# Altium schematic sheet 0161_VCCDD2_CPU VR.SchDoc
size 848 x 558 mm
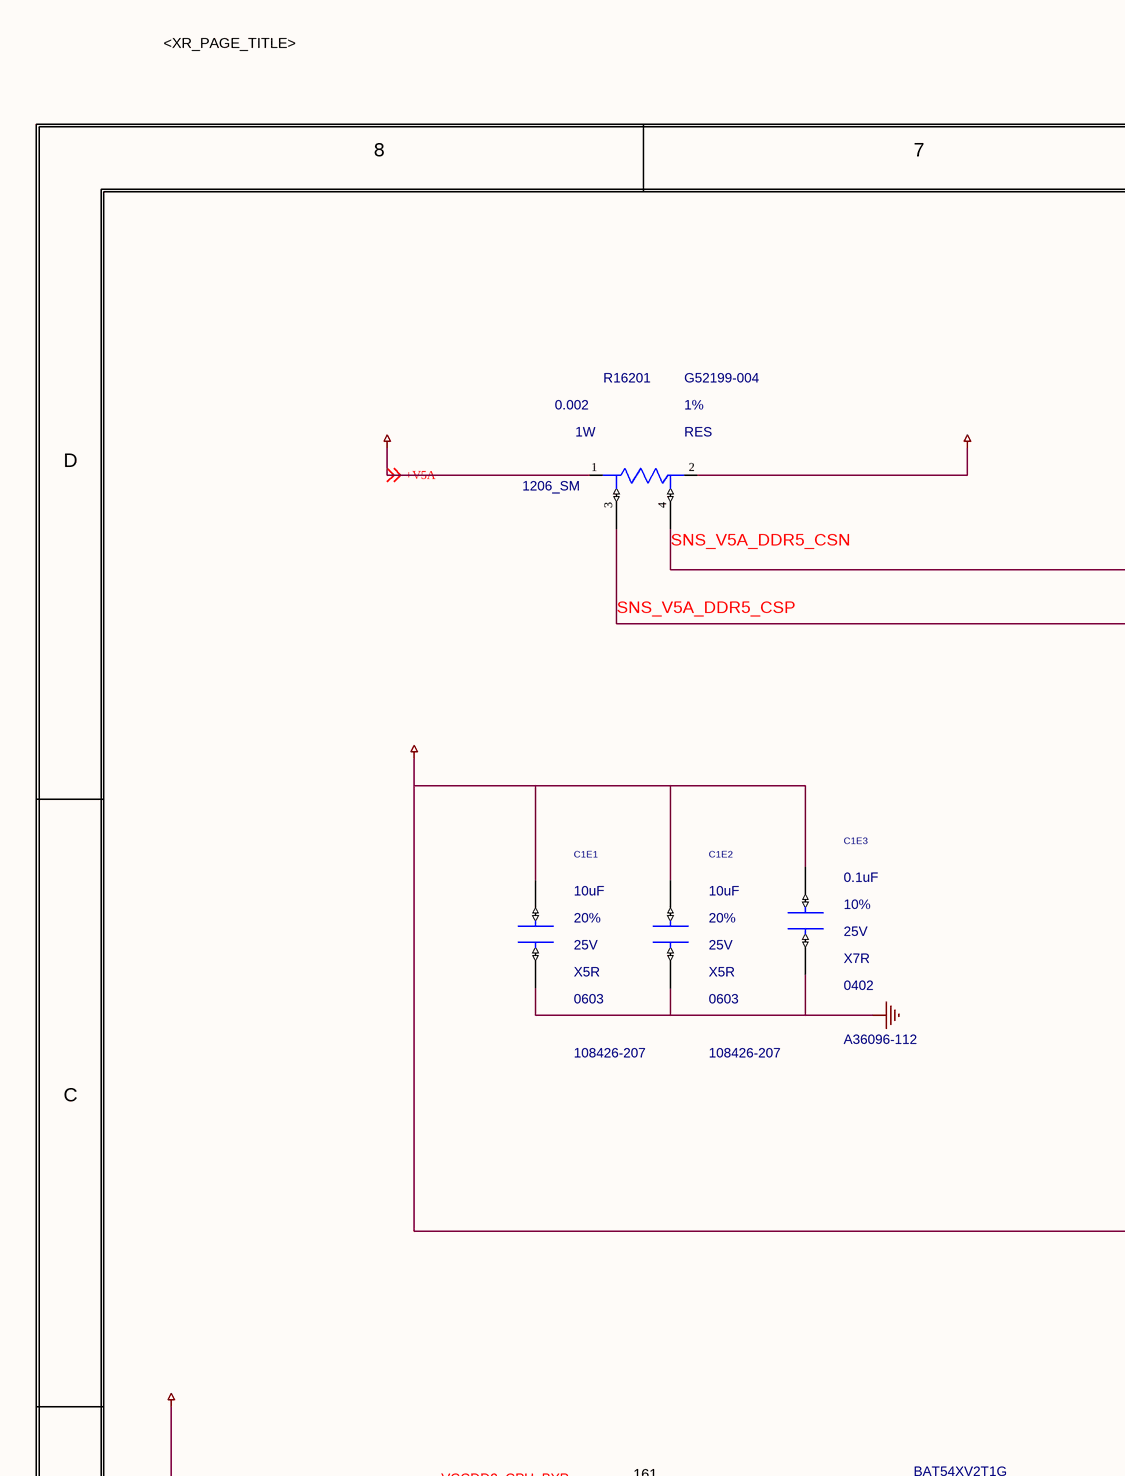
[diagram p0: 0161_VCCDD2_CPU VR.SchDoc, top left]
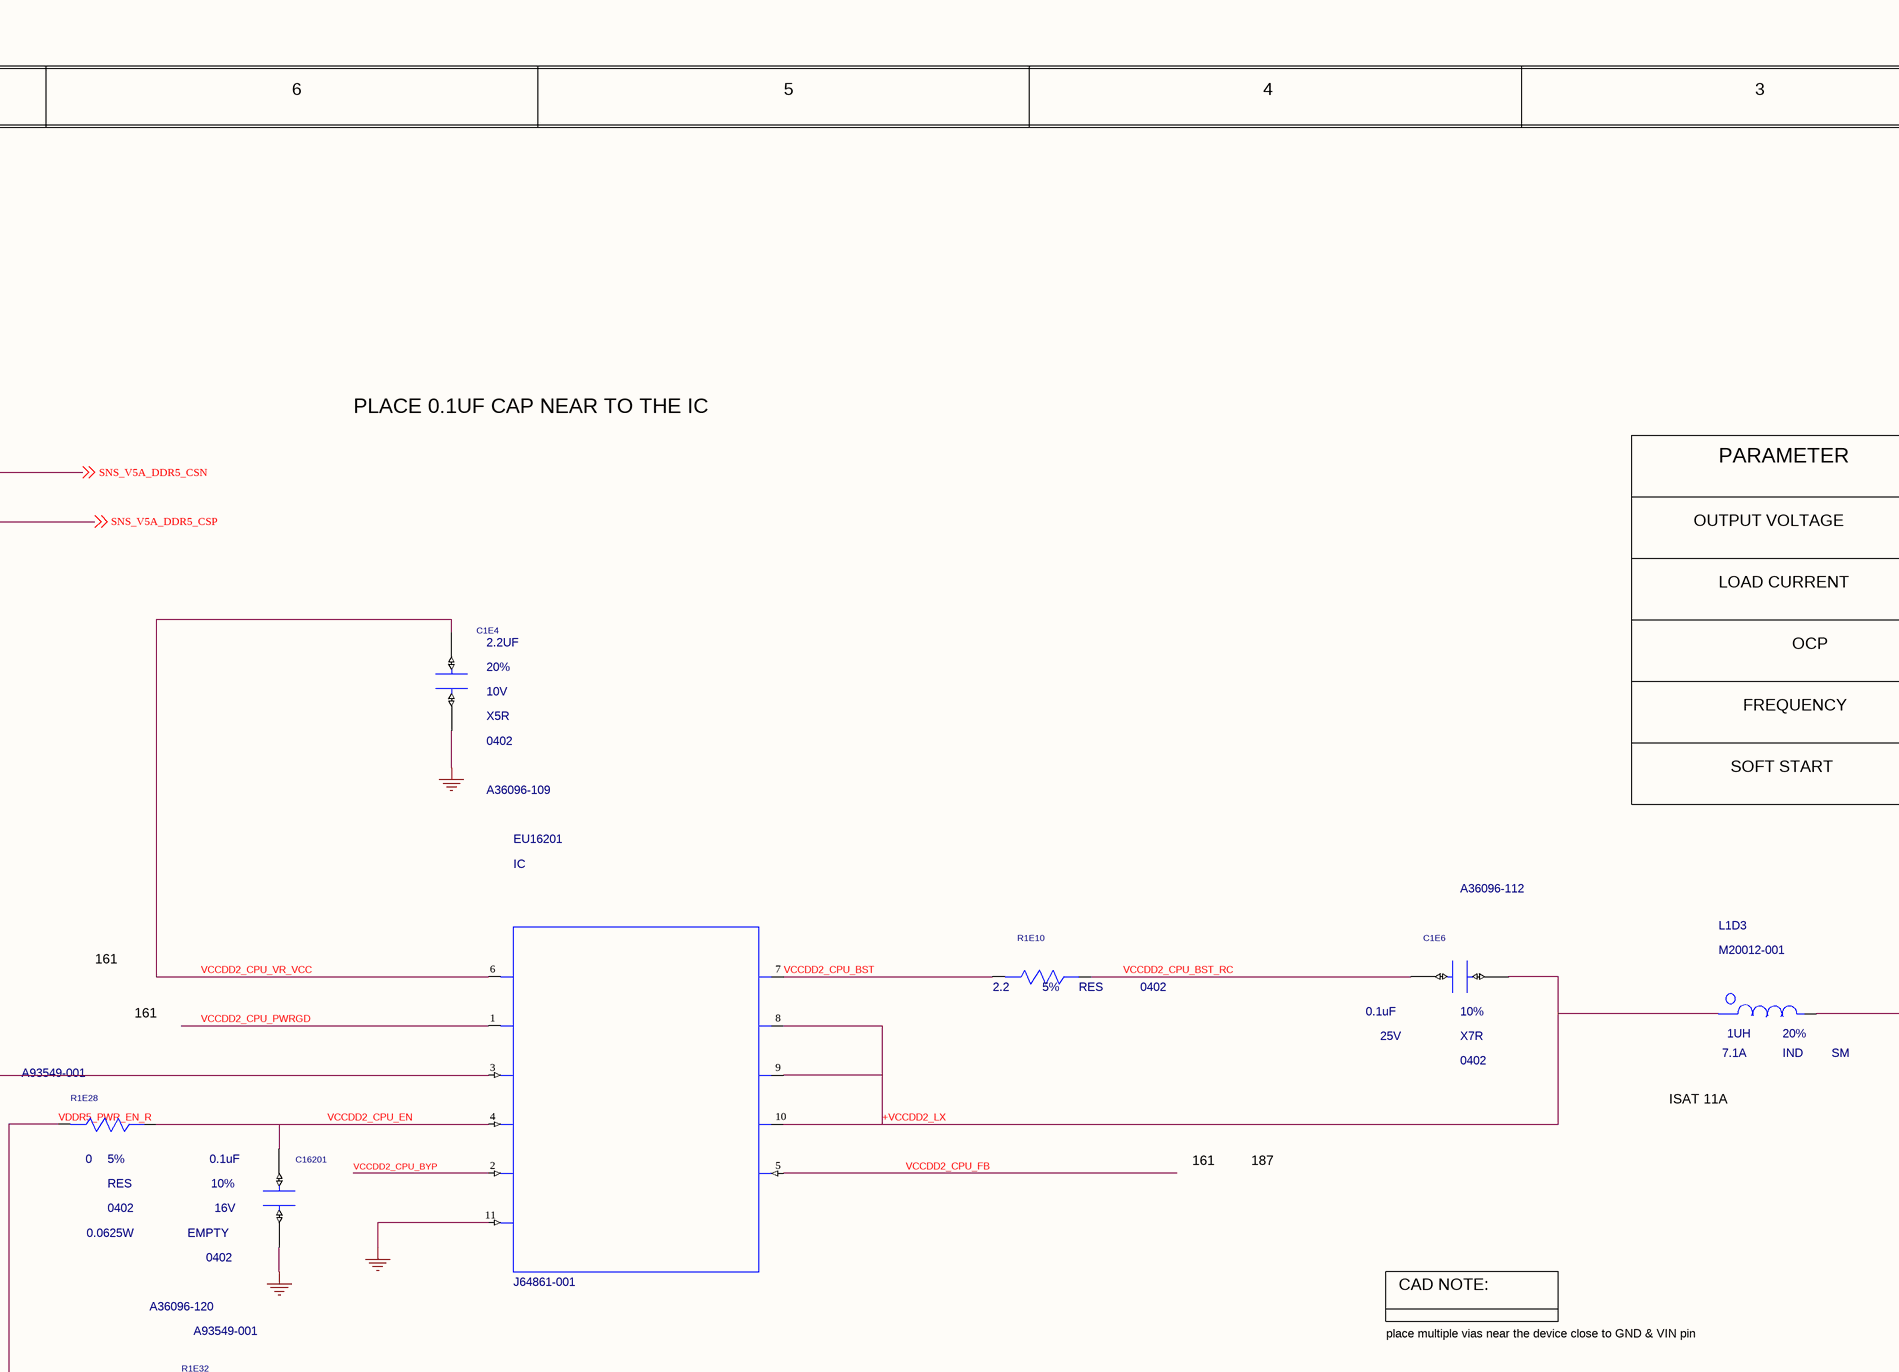
[diagram p1: 0161_VCCDD2_CPU VR.SchDoc, top middle]
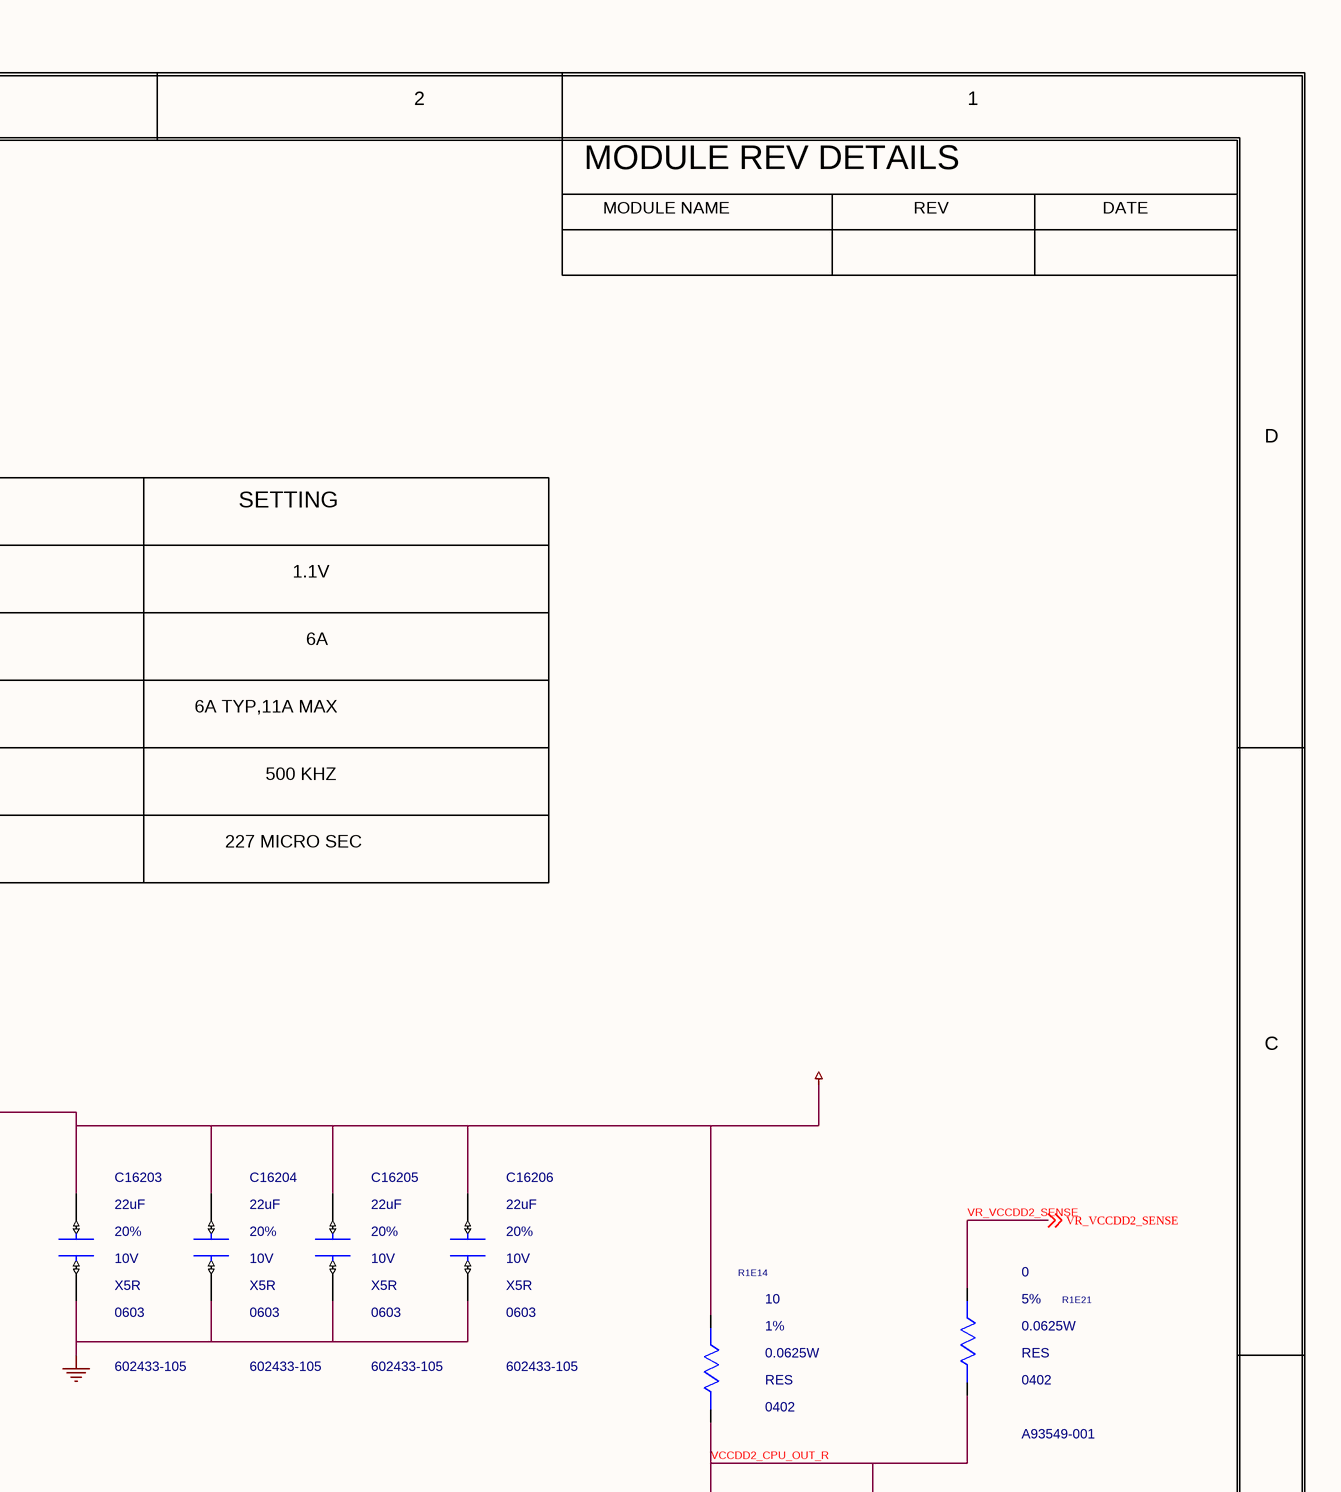
[diagram p2: 0161_VCCDD2_CPU VR.SchDoc, top right]
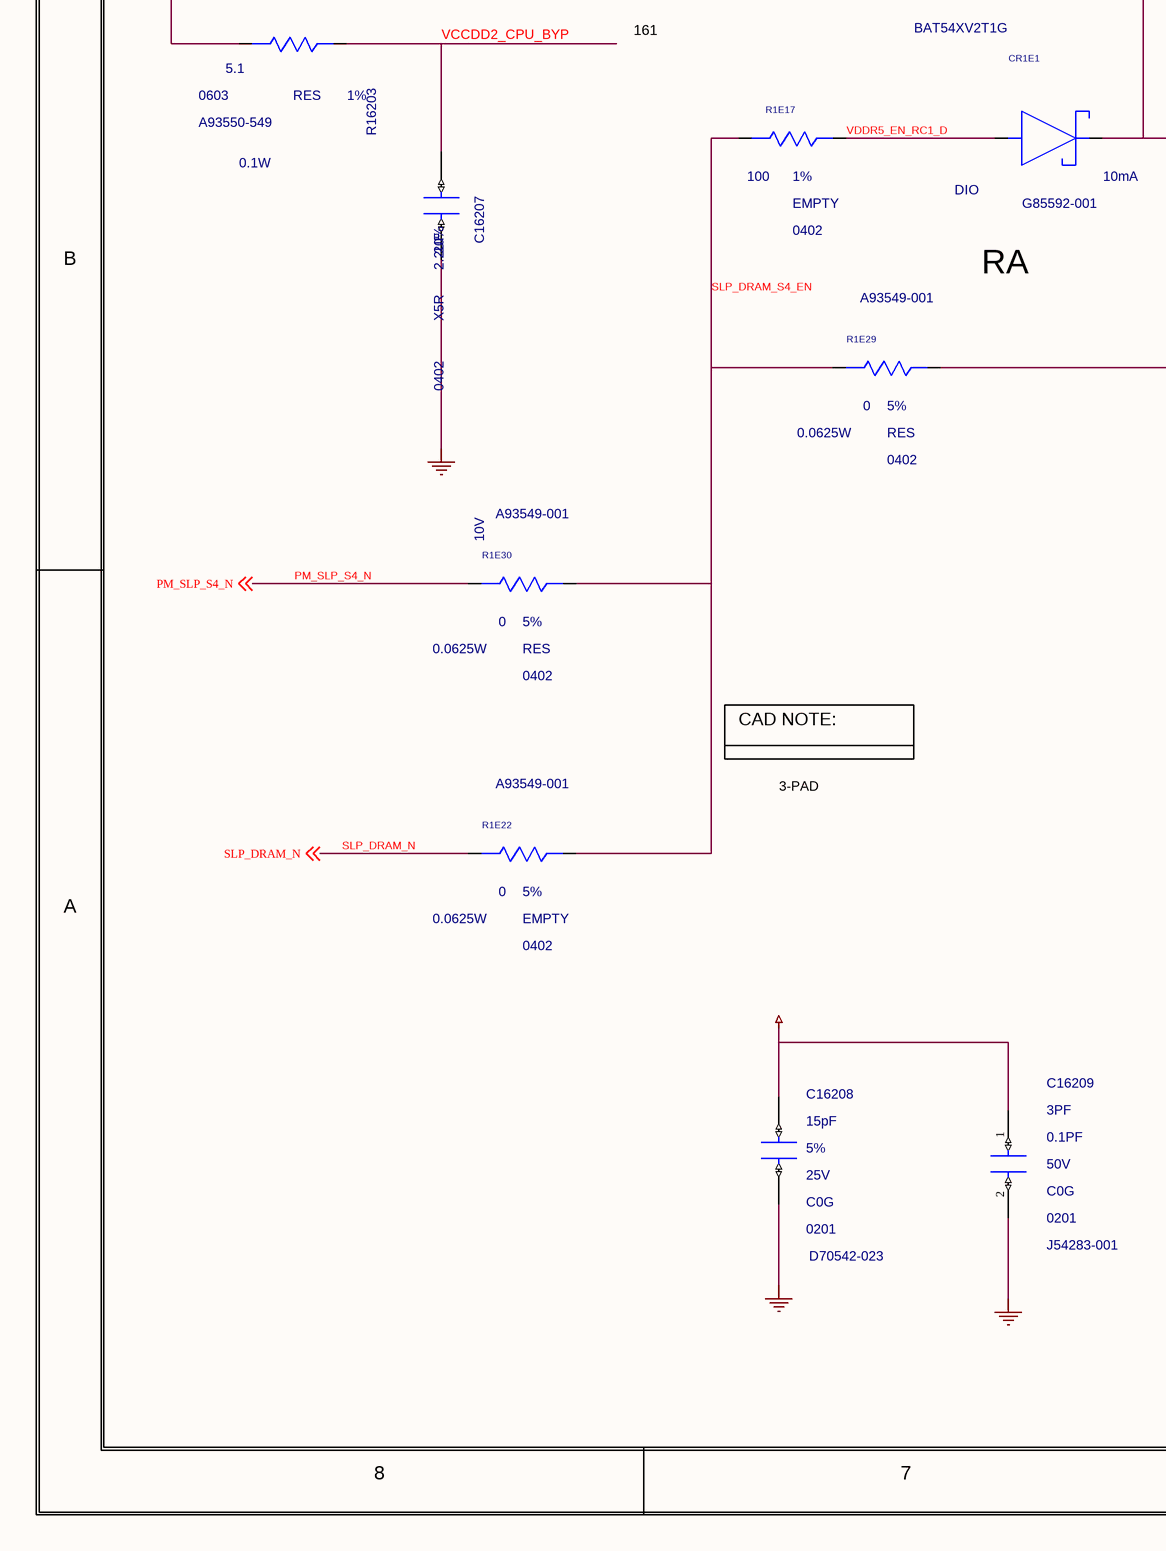
[diagram p3: 0161_VCCDD2_CPU VR.SchDoc, bottom left]
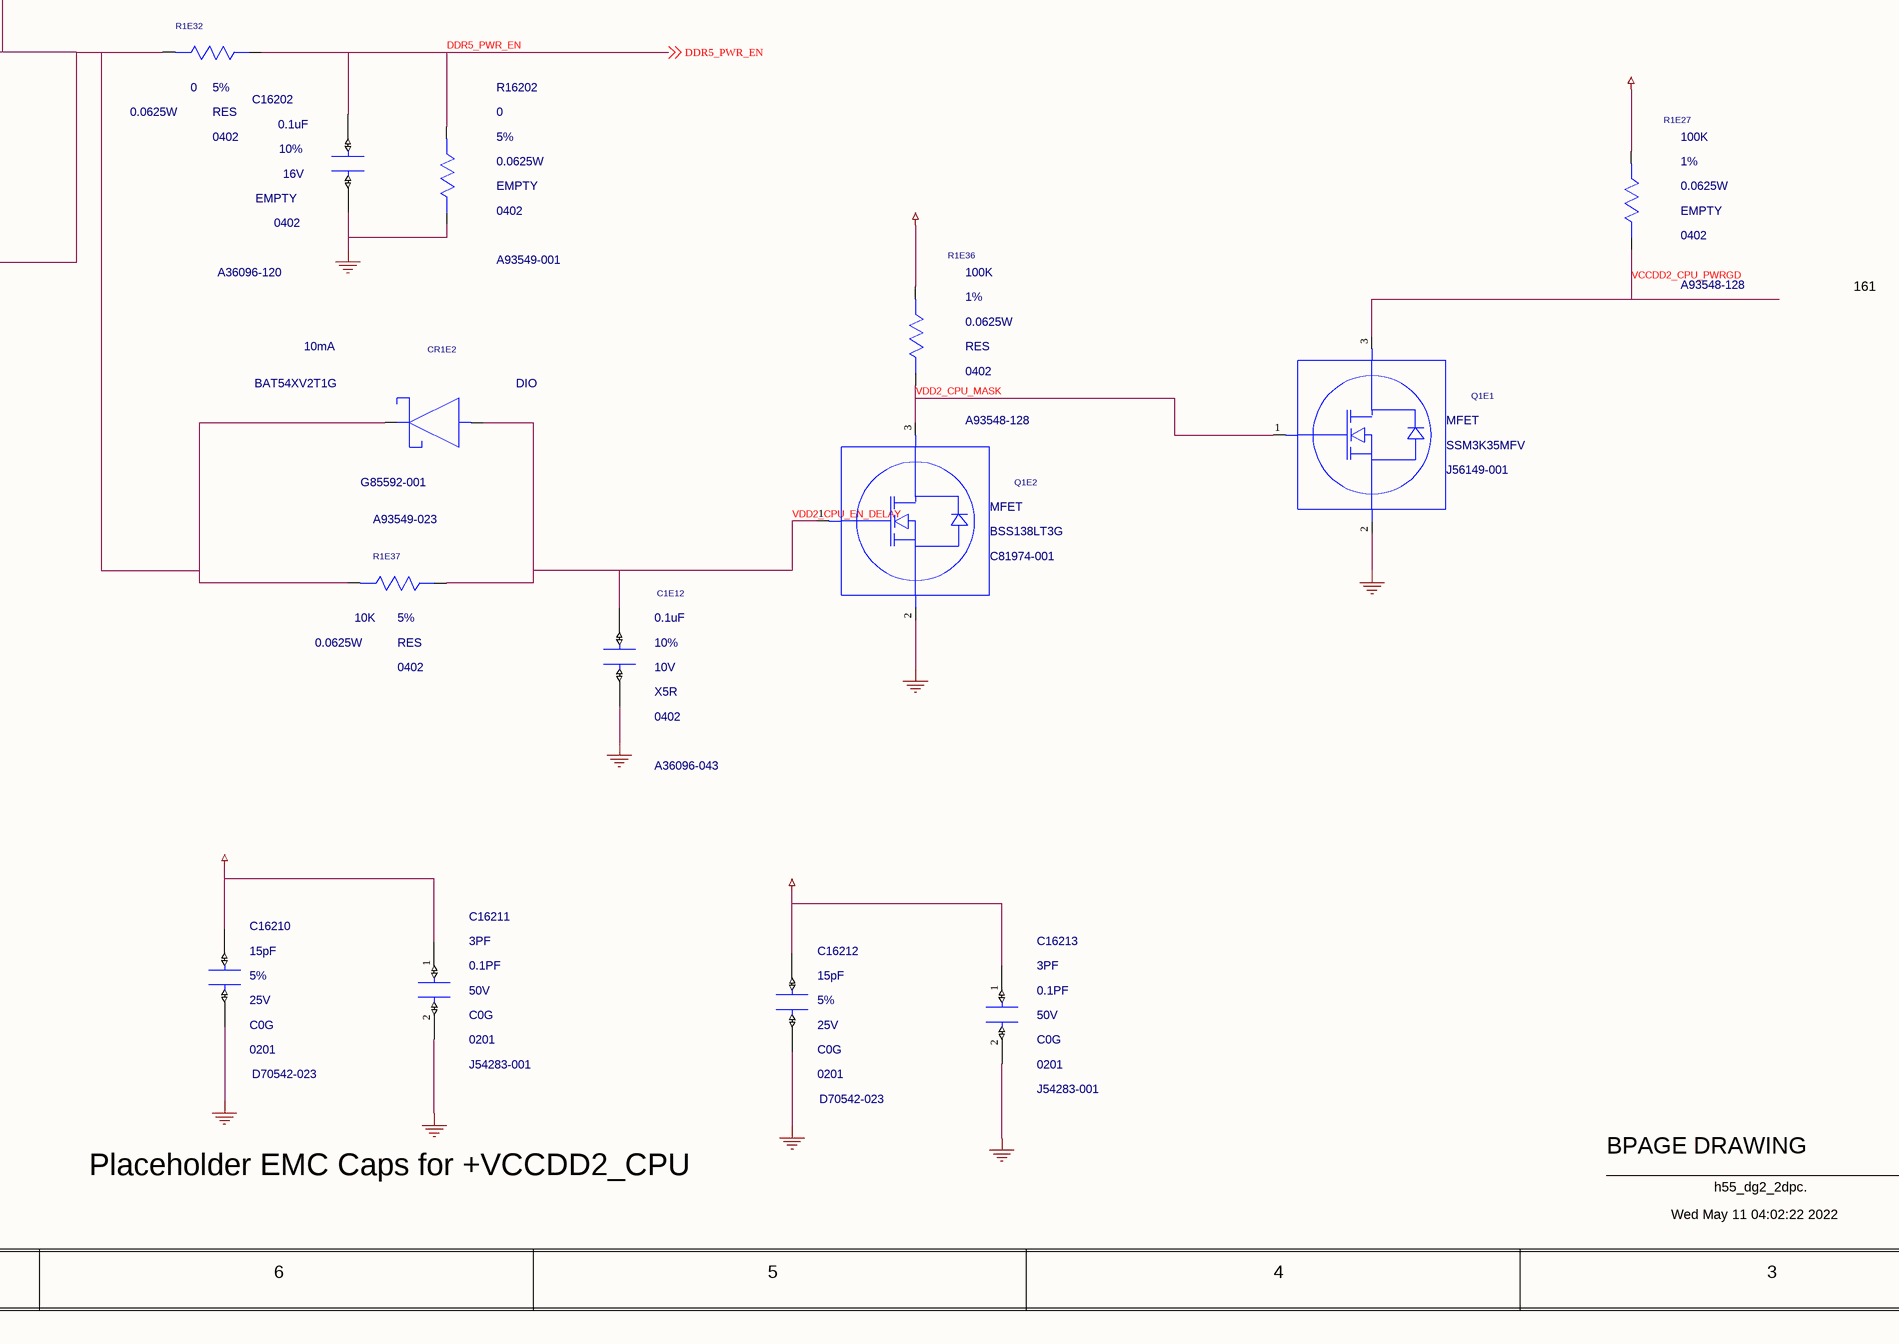
[diagram p4: 0161_VCCDD2_CPU VR.SchDoc, bottom middle]
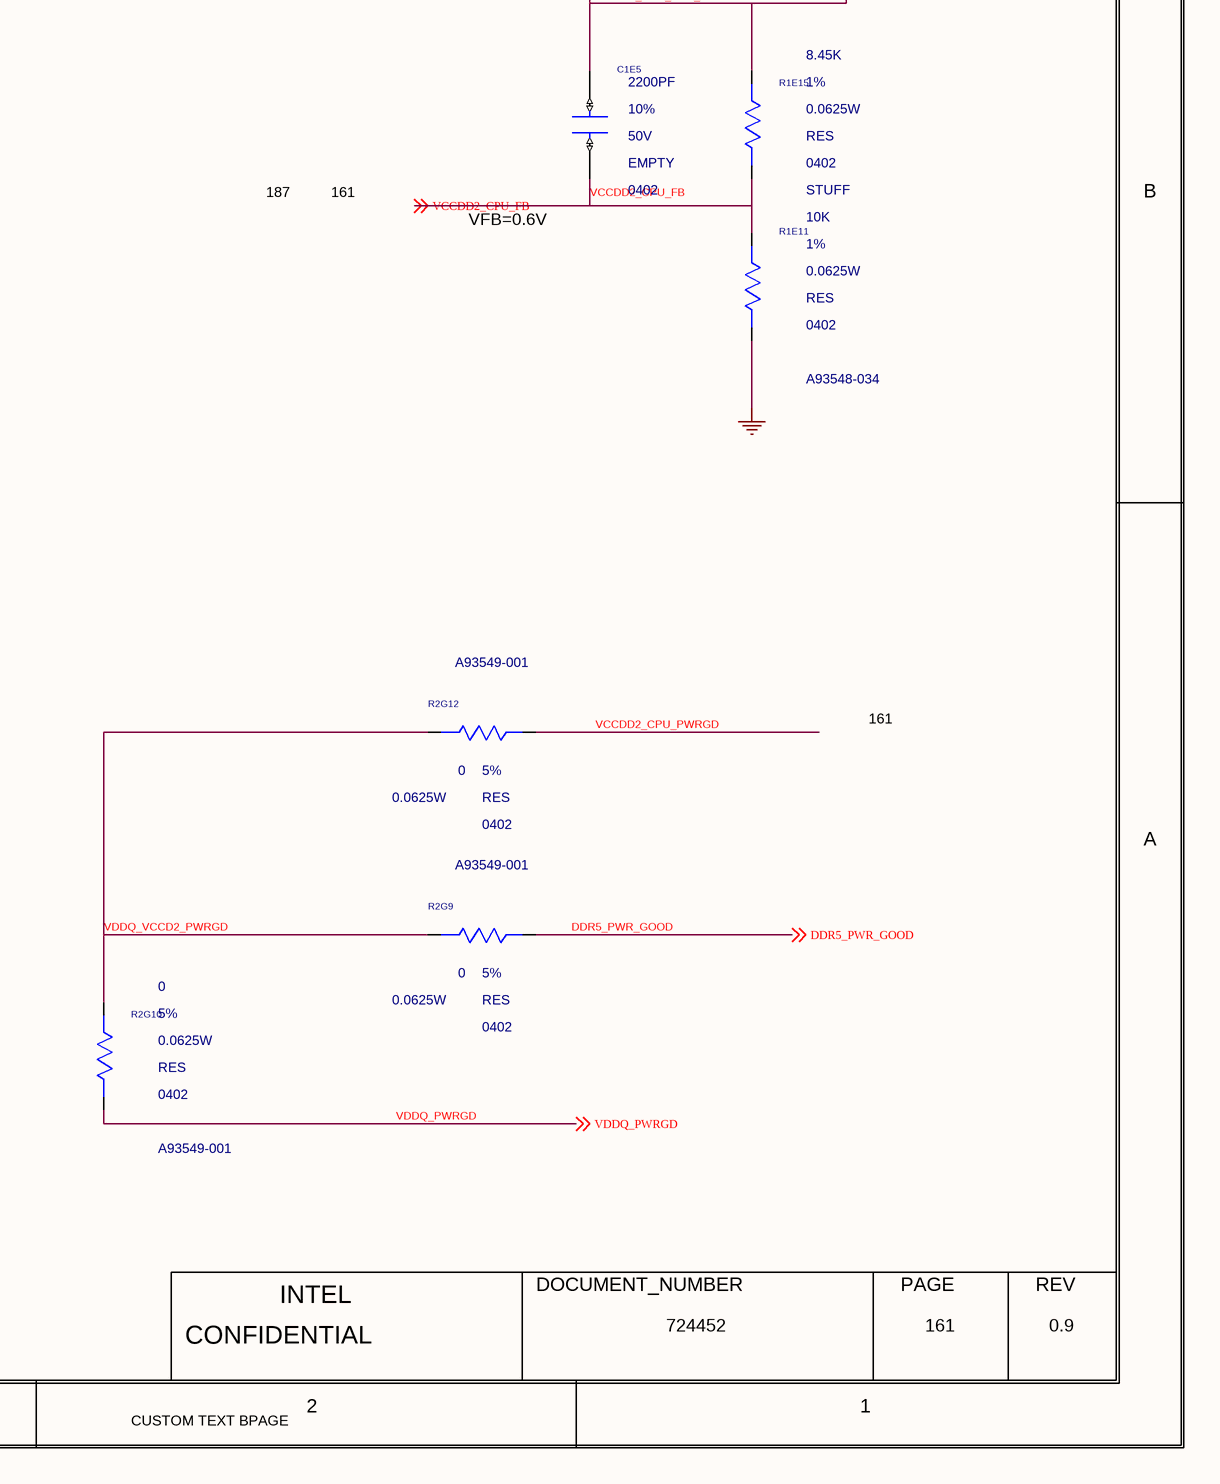
[diagram p5: 0161_VCCDD2_CPU VR.SchDoc, bottom right]

## Parts
C1E1  10uF  MATERIAL: X5R  PACK_TYPE: 0603  PART_NUMBER: 108426-207  TOLERANCE: 20%  VOLTAGE: 25V  [CTK0_SM0603_1800X1000_MA]
C1E2  10uF  MATERIAL: X5R  PACK_TYPE: 0603  PART_NUMBER: 108426-207  TOLERANCE: 20%  VOLTAGE: 25V  [CTK0_SM0603_1800X1000_MA]
C1E3  0.1uF  MATERIAL: X7R  PACK_TYPE: 0402  PART_NUMBER: A36096-112  TOLERANCE: 10%  VOLTAGE: 25V  [CTK2_SM0402_1050X550_MA]
C1E4  2.2UF  MATERIAL: X5R  PACK_TYPE: 0402  PART_NUMBER: A36096-109  TOLERANCE: 20%  VOLTAGE: 10V  [CTK0_SM0402_1070X570_MA]
C1E5  2200PF  MATERIAL: EMPTY  PACK_TYPE: 0402  TOLERANCE: 10%  VOLTAGE: 50V  [CTK0_SM0402_1100X600_MA]
C1E6  0.1uF  MATERIAL: X7R  PACK_TYPE: 0402  PART_NUMBER: A36096-112  TOLERANCE: 10%  VOLTAGE: 25V  [CTK0_SM0402_1050X550_MA]
C1E12  0.1uF  MATERIAL: X5R  PACK_TYPE: 0402  PART_NUMBER: A36096-043  TOLERANCE: 10%  VOLTAGE: 10V  [CTK0_SM0402_1050X550_MA]
C16201  0.1uF  MATERIAL: EMPTY  PACK_TYPE: 0402  PART_NUMBER: A36096-120  TOLERANCE: 10%  VOLTAGE: 16V  [CTK0_SM0402_1050X550_MA]
C16202  0.1uF  MATERIAL: EMPTY  PACK_TYPE: 0402  PART_NUMBER: A36096-120  TOLERANCE: 10%  VOLTAGE: 16V  [CTK0_SM0402_1050X550_MA]
C16203  22uF  MATERIAL: X5R  PACK_TYPE: 0603  PART_NUMBER: 602433-105  TOLERANCE: 20%  VOLTAGE: 10V  [CTK0_SM0603_1850X1050_MA]
C16204  22uF  MATERIAL: X5R  PACK_TYPE: 0603  PART_NUMBER: 602433-105  TOLERANCE: 20%  VOLTAGE: 10V  [CTK0_SM0603_1850X1050_MA]
C16205  22uF  MATERIAL: X5R  PACK_TYPE: 0603  PART_NUMBER: 602433-105  TOLERANCE: 20%  VOLTAGE: 10V  [CTK0_SM0603_1850X1050_MA]
C16206  22uF  MATERIAL: X5R  PACK_TYPE: 0603  PART_NUMBER: 602433-105  TOLERANCE: 20%  VOLTAGE: 10V  [CTK0_SM0603_1850X1050_MA]
C16207  2.2UF  MATERIAL: X5R  PACK_TYPE: 0402  TOLERANCE: 20%  VOLTAGE: 10V  [CTK2_SM0402_1070X570_MA]
C16208  15pF  MATERIAL: C0G  PACK_TYPE: 0201  PART_NUMBER: D70542-023  TOLERANCE: 5%  VOLTAGE: 25V  [CTK0_SM0201_630X330_MA]
C16209  3PF  MATERIAL: C0G  PACK_TYPE: 0201  PART_NUMBER: J54283-001  TOLERANCE: 0.1PF  VOLTAGE: 50V  [SMC0201MA]
C16210  15pF  MATERIAL: C0G  PACK_TYPE: 0201  PART_NUMBER: D70542-023  TOLERANCE: 5%  VOLTAGE: 25V  [CTK0_SM0201_630X330_MA]
C16211  3PF  MATERIAL: C0G  PACK_TYPE: 0201  PART_NUMBER: J54283-001  TOLERANCE: 0.1PF  VOLTAGE: 50V  [SMC0201MA]
C16212  15pF  MATERIAL: C0G  PACK_TYPE: 0201  PART_NUMBER: D70542-023  TOLERANCE: 5%  VOLTAGE: 25V  [CTK0_SM0201_630X330_MA]
C16213  3PF  MATERIAL: C0G  PACK_TYPE: 0201  PART_NUMBER: J54283-001  TOLERANCE: 0.1PF  VOLTAGE: 50V  [SMC0201MA]
CR1E1  BAT54XV2T1G  CURRENT: 10mA  MATERIAL: DIO  PART_NUMBER: G85592-001  [CTK2_SCR_1300X900_MA]
CR1E2  BAT54XV2T1G  CURRENT: 10mA  MATERIAL: DIO  PART_NUMBER: G85592-001  [CTK2_SCR_1300X900_MA]
EU16201  MATERIAL: IC  PART_NUMBER: J64861-001  [CTK2_LCC10_S3050_DF1625X2475_500_MA]  (hidden comment: C_RT6219)
L1D3  1UH  CURRENT: 7.1A  MATERIAL: IND  PACK_TYPE: SM  PART_NUMBER: M20012-001  TOLERANCE: 20%  [CTK0_SMI3225M_3350X2650_MA_VR]
Q1E1  SSM3K35MFV  MATERIAL: MFET  PART_NUMBER: J56149-001  [CTK2_SOT723_850X1250_400_MA]
Q1E2  BSS138LT3G  MATERIAL: MFET  PART_NUMBER: C81974-001  [CTK2_SOT23_1400X3040_950_MA]
R1E10  2.2  MATERIAL: RES  PACK_TYPE: 0402  TOLERANCE: 5%  [CTK0_SM0402_1100X550_MA]
R1E11  10K  MATERIAL: RES  PACK_TYPE: 0402  PART_NUMBER: A93548-034  TOLERANCE: 1%  WATTAGE: 0.0625W  [CTK0_SM0402_1100X550_MA]
R1E14  10  MATERIAL: RES  PACK_TYPE: 0402  TOLERANCE: 1%  WATTAGE: 0.0625W  [CTK0_SM0402_1100X550_MA]
R1E15  8.45K  BOM_USE: STUFF  MATERIAL: RES  PACK_TYPE: 0402  TOLERANCE: 1%  WATTAGE: 0.0625W  [TK0_SM0402_1100X550_MD]
R1E17  100  MATERIAL: EMPTY  PACK_TYPE: 0402  TOLERANCE: 1%  [CTK0_SM0402_1050X550_MA]
R1E21  0  MATERIAL: RES  PACK_TYPE: 0402  PART_NUMBER: A93549-001  TOLERANCE: 5%  WATTAGE: 0.0625W  [CTK0_SM0402_1100X550_MA]
R1E22  0  MATERIAL: EMPTY  PACK_TYPE: 0402  PART_NUMBER: A93549-001  TOLERANCE: 5%  WATTAGE: 0.0625W  [CTK0_SM0402_1100X550_MA]
R1E27  100K  MATERIAL: EMPTY  PACK_TYPE: 0402  PART_NUMBER: A93548-128  TOLERANCE: 1%  WATTAGE: 0.0625W  [CTK0_SM0402_1100X550_MA]
R1E28  0  MATERIAL: RES  PACK_TYPE: 0402  PART_NUMBER: A93549-001  TOLERANCE: 5%  WATTAGE: 0.0625W  [CTK0_SM0402_1100X550_MA]
R1E29  0  MATERIAL: RES  PACK_TYPE: 0402  PART_NUMBER: A93549-001  TOLERANCE: 5%  WATTAGE: 0.0625W  [CTK0_SM0402_1100X550_MA]
R1E30  0  MATERIAL: RES  PACK_TYPE: 0402  PART_NUMBER: A93549-001  TOLERANCE: 5%  WATTAGE: 0.0625W  [CTK0_SM0402_1100X550_MA]
R1E32  0  MATERIAL: RES  PACK_TYPE: 0402  PART_NUMBER: A93549-001  TOLERANCE: 5%  WATTAGE: 0.0625W  [CTK0_SM0402_1100X550_MA]
R1E36  100K  MATERIAL: RES  PACK_TYPE: 0402  PART_NUMBER: A93548-128  TOLERANCE: 1%  WATTAGE: 0.0625W  [CTK2_SM0402_1100X550_MA]
R1E37  10K  MATERIAL: RES  PACK_TYPE: 0402  PART_NUMBER: A93549-023  TOLERANCE: 5%  WATTAGE: 0.0625W  [CTK0_SM0402_1100X550_MA]
R2G9  0  MATERIAL: RES  PACK_TYPE: 0402  PART_NUMBER: A93549-001  TOLERANCE: 5%  WATTAGE: 0.0625W  [CTK0_SM0402_1100X550_MA]
R2G10  0  MATERIAL: RES  PACK_TYPE: 0402  PART_NUMBER: A93549-001  TOLERANCE: 5%  WATTAGE: 0.0625W  [CTK0_SM0402_1100X550_MA]
R2G12  0  MATERIAL: RES  PACK_TYPE: 0402  PART_NUMBER: A93549-001  TOLERANCE: 5%  WATTAGE: 0.0625W  [CTK0_SM0402_1100X550_MA]
R16201  0.002  MATERIAL: RES  PACK_TYPE: 1206_SM  PART_NUMBER: G52199-004  TOLERANCE: 1%  WATTAGE: 1W  [CTK2_SMR4_1206_3454X1854_ME]
R16202  0  MATERIAL: EMPTY  PACK_TYPE: 0402  PART_NUMBER: A93549-001  TOLERANCE: 5%  WATTAGE: 0.0625W  [CTK2_SM0402_1100X550_MA]
R16203  5.1  MATERIAL: RES  PACK_TYPE: 0603  PART_NUMBER: A93550-549  TOLERANCE: 1%  WATTAGE: 0.1W  [CTK2_SM0603_1800X900_MA]

## Nets
+V3P3S: R1E27.1(A) R1E36.1(A)
+V5A: R16201.1(PWRA) R16203.2(B) ; off-sheet +V5A
+V5A_DDR5: R16201.2(PWRB)
+VBATA: C1E1.1(A) C1E2.1(A) C1E3.1(A) EU16201.3(VIN)
+VCCDD2_PROC: C16203.1(A) C16204.1(A) C16205.1(A) C16206.1(A) C16208.1(A) C16209.1(A) C16210.1(A) C16211.1(A) C16212.1(A) C16213.1(A) L1D3.2(B) R1E14.1(A)
GND: C1E1.2(B) C1E2.2(B) C1E3.2(B) C1E4.2(B) C1E12.2(B) C16201.2(B) C16202.2(B) C16203.2(B) C16204.2(B) C16205.2(B) C16206.2(B) C16207.2(B) C16208.2(B) C16209.2(B) C16210.2(B) C16211.2(B) C16212.2(B) C16213.2(B) EU16201.11(PGND_TPD) Q1E1.2(S) Q1E2.2(S) R1E11.2(B) R16202.2(B)
+VCCDD2_LX: C1E6.2(B) EU16201.8(SW_1) EU16201.9(SW_2) EU16201.10(SW_3) L1D3.1(A)
DDR5_PWR_EN: C16202.1(A) R1E32.2(B) R16202.1(A) ; off-sheet DDR5_PWR_EN
DDR5_PWR_GOOD: R2G9.2(B) ; off-sheet DDR5_PWR_GOOD
PM_SLP_S4_N: R1E30.1(A) ; off-sheet PM_SLP_S4_N
SLP_DRAM_N: R1E22.1(A) ; off-sheet SLP_DRAM_N
SLP_DRAM_S4_EN: R1E17.1(A) R1E22.2(B) R1E29.1(A) R1E30.2(B)
SNS_V5A_DDR5_CSN: R16201.4(SENB) ; off-sheet SNS_V5A_DDR5_CSN
SNS_V5A_DDR5_CSP: R16201.3(SENA) ; off-sheet SNS_V5A_DDR5_CSP
VCCDD2_CPU_BST: EU16201.7(BOOT) R1E10.1(A)
VCCDD2_CPU_BST_RC: C1E6.1(A) R1E10.2(B)
VCCDD2_CPU_BYP: C16207.1(A) EU16201.2(VBYP) R16203.1(A)
VCCDD2_CPU_EN: C16201.1(A) EU16201.4(EN) R1E28.2(B)
VCCDD2_CPU_FB: C1E5.2(B) EU16201.5(FB) R1E11.1(A) R1E15.2(B) ; off-sheet VCCDD2_CPU_FB
VCCDD2_CPU_OUT_R: C1E5.1(A) R1E14.2(B) R1E15.1(A) R1E21.2(B)
VCCDD2_CPU_PWRGD: EU16201.1(PGOOD) Q1E1.3(D) R1E27.2(B) R2G12.2(B)
VCCDD2_CPU_VR_VCC: C1E4.1(A) EU16201.6(VCC)
VDD2_CPU_EN_DELAY: C1E12.1(A) CR1E2.A(ANODE) Q1E2.1(G) R1E37.2(B)
VDD2_CPU_MASK: Q1E1.1(G) Q1E2.3(D) R1E36.2(B)
VDDQ_PWRGD: R2G10.2(B) ; off-sheet VDDQ_PWRGD
VDDQ_VCCD2_PWRGD: R2G9.1(A) R2G10.1(A) R2G12.1(A)
VDDR5_EN_RC1_D: CR1E1.A(ANODE) R1E17.2(B)
VDDR5_PWR_EN_R: CR1E1.C(CATHODE) CR1E2.C(CATHODE) R1E28.1(A) R1E29.2(B) R1E32.1(A) R1E37.1(A)
VR_VCCDD2_SENSE: R1E21.1(A) ; off-sheet VR_VCCDD2_SENSE

## Notes on the sheet
- <XR_PAGE_TITLE>
- 8
- 7
- 6
- 5
- 4
- 3
- 2
- 1
- MODULE REV DETAILS
- MODULE NAME
- REV
- DATE
- D
- PLACE 0.1UF CAP NEAR TO THE IC
- PARAMETER
- SETTING
- OUTPUT VOLTAGE
- 1.1V
- LOAD CURRENT
- 6A
- OCP
- 6A TYP,11A MAX
- FREQUENCY
- 500 KHZ
- SOFT START
- 227 MICRO SEC
- C
- 161
- ISAT 11A
- 187
- CAD NOTE:
- place multiple vias near the device close to GND & VIN pin
- B
- RA
- VFB=0.6V
- 3-PAD
- A
- Placeholder EMC Caps for +VCCDD2_CPU
- BPAGE DRAWING
- INTEL
- DOCUMENT_NUMBER
- PAGE
- Wed May 11 04:02:22 2022
- h55_dg2_2dpc.
- CONFIDENTIAL
- 724452
- 0.9
- CUSTOM TEXT BPAGE

## Library data of the parts
C1E1 = C_CAP: CDS_PHYS_PART_NAME: C_CAP_0603-108426-207,X5R,10UF,25V,20%,TK0,GENERIC; CDS_LMAN_SYM_OUTLINE: -50,50,50,-50; FP_TECH: TK0; IP: GENERIC; ROOM: NONE; OriginalSymbolOrigin: (-50,25); XY: (2350,9475); VER: 1; ROT: 0; PHYS_PAGE: 161; LOCATION: C1E1; DRAWING: @RVP1_ADL_SB_ADP_S_DDR5_SODIMM_2DPC_LIB.H55_DG2_2DPC(SCH_1):PAGE530; CDS_LIB: c_discrete; VARIANT: ?; PCB Footprint: CTK0_SM0603_1800X1000_MA; SEC_TYPE: 0603; CHIPS_PART_NAME: C_CAP; CDS_PART_NAME: C_CAP_0603-108426-207,X5R,10UF,25V,20%,TK0,GENERIC; CDS_LOCATION: C1E1
C1E2 = C_CAP: CDS_PHYS_PART_NAME: C_CAP_0603-108426-207,X5R,10UF,25V,20%,TK0,GENERIC; CDS_LMAN_SYM_OUTLINE: -50,50,50,-50; FP_TECH: TK0; IP: GENERIC; ROOM: NONE; OriginalSymbolOrigin: (-50,25); XY: (2600,9475); VER: 1; ROT: 0; PHYS_PAGE: 161; LOCATION: C1E2; DRAWING: @RVP1_ADL_SB_ADP_S_DDR5_SODIMM_2DPC_LIB.H55_DG2_2DPC(SCH_1):PAGE530; CDS_LIB: c_discrete; VARIANT: ?; PCB Footprint: CTK0_SM0603_1800X1000_MA; SEC_TYPE: 0603; CHIPS_PART_NAME: C_CAP; CDS_PART_NAME: C_CAP_0603-108426-207,X5R,10UF,25V,20%,TK0,GENERIC; CDS_LOCATION: C1E2
C1E3 = C_CAP: CDS_PHYS_PART_NAME: C_CAP_0402-A36096-112,X7R,0.1UF,25V,10%,TK2,GENERIC; CDS_LMAN_SYM_OUTLINE: -50,50,50,-50; FP_TECH: TK2; IP: GENERIC; ROOM: NONE; OriginalSymbolOrigin: (-50,25); XY: (2850,9500); VER: 1; ROT: 0; PHYS_PAGE: 161; LOCATION: C1E3; DRAWING: @RVP1_ADL_SB_ADP_S_DDR5_SODIMM_2DPC_LIB.H55_DG2_2DPC(SCH_1):PAGE530; CDS_LIB: c_discrete; VARIANT: ?; PCB Footprint: CTK2_SM0402_1050X550_MA; SEC_TYPE: 0402; CHIPS_PART_NAME: C_CAP; CDS_PART_NAME: C_CAP_0402-A36096-112,X7R,0.1UF,25V,10%,TK2,GENERIC; CDS_LOCATION: C1E3
C1E4 = C_CAP: CDS_PHYS_PART_NAME: C_CAP_0402-A36096-109,X5R,2.2UF,10V,20%,TK0,GENERIC; CDS_LMAN_SYM_OUTLINE: -50,50,50,-50; FP_TECH: TK0; IP: GENERIC; ROOM: NONE; OriginalSymbolOrigin: (-50,25); XY: (4375,9725); VER: 1; ROT: 0; PHYS_PAGE: 161; LOCATION: C1E4; DRAWING: @RVP1_ADL_SB_ADP_S_DDR5_SODIMM_2DPC_LIB.H55_DG2_2DPC(SCH_1):PAGE530; CDS_LIB: c_discrete; VARIANT: ?; PCB Footprint: CTK0_SM0402_1070X570_MA; SEC_TYPE: 0402; CHIPS_PART_NAME: C_CAP; CDS_PART_NAME: C_CAP_0402-A36096-109,X5R,2.2UF,10V,20%,TK0,GENERIC; CDS_LOCATION: C1E4
C1E5 = C_CAP: PART_NUMBER: A36096-075; CDS_PHYS_PART_NAME: C_CAP_0402-A36096-075,EMPTY,2200PF,50V,10%,TK0,GENERIC; CDS_LMAN_SYM_OUTLINE: -50,50,50,-50; FP_TECH: TK0; IP: GENERIC; ROOM: NONE; OriginalSymbolOrigin: (-50,25); XY: (8575,8175); VER: 1; ROT: 0; PHYS_PAGE: 161; LOCATION: C1E5; DRAWING: @RVP1_ADL_SB_ADP_S_DDR5_SODIMM_2DPC_LIB.H55_DG2_2DPC(SCH_1):PAGE530; CDS_LIB: c_discrete; VARIANT: ?; PCB Footprint: CTK0_SM0402_1100X600_MA; SEC_TYPE: 0402; CHIPS_PART_NAME: C_CAP; CDS_PART_NAME: C_CAP_0402-A36096-075,EMPTY,2200PF,50V,10%,TK0,GENERIC; CDS_LOCATION: C1E5
C1E6 = C_CAP#1: CHIPS_PART_NAME: C_CAP; CDS_PHYS_PART_NAME: C_CAP_0402-A36096-112,X7R,0.1UF,25V,10%,TK0,GENERIC; CDS_LMAN_SYM_OUTLINE: -50,50,50,-50; FP_TECH: TK0; IP: GENERIC; ROOM: NONE; OriginalSymbolOrigin: (-25,50); XY: (6425,9125); VER: 2; ROT: 0; PHYS_PAGE: 161; LOCATION: C1E6; DRAWING: @RVP1_ADL_SB_ADP_S_DDR5_SODIMM_2DPC_LIB.H55_DG2_2DPC(SCH_1):PAGE530; CDS_LIB: c_discrete; VARIANT: ?; PCB Footprint: CTK0_SM0402_1050X550_MA; SEC_TYPE: 0402; CDS_PART_NAME: C_CAP_0402-A36096-112,X7R,0.1UF,25V,10%,TK0,GENERIC; CDS_LOCATION: C1E6
C1E12 = C_CAP: CDS_PHYS_PART_NAME: C_CAP_0402-A36096-043,X5R,0.1UF,10V,10%,TK0,GENERIC; CDS_LMAN_SYM_OUTLINE: -50,50,50,-50; FP_TECH: TK0; IP: GENERIC; ROOM: NONE; OriginalSymbolOrigin: (-50,25); XY: (4725,7050); VER: 1; ROT: 0; PHYS_PAGE: 161; LOCATION: C1E12; DRAWING: @RVP1_ADL_SB_ADP_S_DDR5_SODIMM_2DPC_LIB.H55_DG2_2DPC(SCH_1):PAGE530; CDS_LIB: c_discrete; VARIANT: ?; PCB Footprint: CTK0_SM0402_1050X550_MA; SEC_TYPE: 0402; CHIPS_PART_NAME: C_CAP; CDS_PART_NAME: C_CAP_0402-A36096-043,X5R,0.1UF,10V,10%,TK0,GENERIC; CDS_LOCATION: C1E12
C16201 = C_CAP: CDS_PHYS_PART_NAME: C_CAP_0402-A36096-120,EMPTY,0.1UF,16V,10%,TK0,GENERIC; CDS_LMAN_SYM_OUTLINE: -50,50,50,-50; FP_TECH: TK0; IP: GENERIC; ROOM: NONE; OriginalSymbolOrigin: (-50,25); XY: (4025,8675); VER: 1; ROT: 2; PHYS_PAGE: 161; LOCATION: C16201; DRAWING: @RVP1_ADL_SB_ADP_S_DDR5_SODIMM_2DPC_LIB.H55_DG2_2DPC(SCH_1):PAGE530; CDS_LIB: c_discrete; VARIANT: ?; PCB Footprint: CTK0_SM0402_1050X550_MA; SEC_TYPE: 0402; CHIPS_PART_NAME: C_CAP; CDS_PART_NAME: C_CAP_0402-A36096-120,EMPTY,0.1UF,16V,10%,TK0,GENERIC; CDS_LOCATION: C16201
C16202 = C_CAP: CDS_PHYS_PART_NAME: C_CAP_0402-A36096-120,EMPTY,0.1UF,16V,10%,TK0,GENERIC; CDS_LMAN_SYM_OUTLINE: -50,50,50,-50; FP_TECH: TK0; IP: GENERIC; ROOM: NONE; OriginalSymbolOrigin: (-50,25); XY: (4175,8050); VER: 1; ROT: 2; PHYS_PAGE: 161; LOCATION: C16202; DRAWING: @RVP1_ADL_SB_ADP_S_DDR5_SODIMM_2DPC_LIB.H55_DG2_2DPC(SCH_1):PAGE530; CDS_LIB: c_discrete; VARIANT: ?; PCB Footprint: CTK0_SM0402_1050X550_MA; SEC_TYPE: 0402; CHIPS_PART_NAME: C_CAP; CDS_PART_NAME: C_CAP_0402-A36096-120,EMPTY,0.1UF,16V,10%,TK0,GENERIC; CDS_LOCATION: C16202
C16203 = C_CAP: CDS_PHYS_PART_NAME: C_CAP_0603-602433-105,X5R,22UF,10V,20%,TK0,GENERIC; CDS_LMAN_SYM_OUTLINE: -50,50,50,-50; FP_TECH: TK0; IP: GENERIC; ROOM: NONE; OriginalSymbolOrigin: (-50,25); XY: (7400,8800); VER: 1; ROT: 0; PHYS_PAGE: 161; LOCATION: C16203; DRAWING: @RVP1_ADL_SB_ADP_S_DDR5_SODIMM_2DPC_LIB.H55_DG2_2DPC(SCH_1):PAGE530; CDS_LIB: c_discrete; VARIANT: ?; PCB Footprint: CTK0_SM0603_1850X1050_MA; SEC_TYPE: 0603; CHIPS_PART_NAME: C_CAP; CDS_PART_NAME: C_CAP_0603-602433-105,X5R,22UF,10V,20%,TK0,GENERIC; CDS_LOCATION: C16203
C16204 = C_CAP: CDS_PHYS_PART_NAME: C_CAP_0603-602433-105,X5R,22UF,10V,20%,TK0,GENERIC; CDS_LMAN_SYM_OUTLINE: -50,50,50,-50; FP_TECH: TK0; IP: GENERIC; ROOM: NONE; OriginalSymbolOrigin: (-50,25); XY: (7650,8800); VER: 1; ROT: 0; PHYS_PAGE: 161; LOCATION: C16204; DRAWING: @RVP1_ADL_SB_ADP_S_DDR5_SODIMM_2DPC_LIB.H55_DG2_2DPC(SCH_1):PAGE530; CDS_LIB: c_discrete; VARIANT: ?; PCB Footprint: CTK0_SM0603_1850X1050_MA; SEC_TYPE: 0603; CHIPS_PART_NAME: C_CAP; CDS_PART_NAME: C_CAP_0603-602433-105,X5R,22UF,10V,20%,TK0,GENERIC; CDS_LOCATION: C16204
C16205 = C_CAP: CDS_PHYS_PART_NAME: C_CAP_0603-602433-105,X5R,22UF,10V,20%,TK0,GENERIC; CDS_LMAN_SYM_OUTLINE: -50,50,50,-50; FP_TECH: TK0; IP: GENERIC; ROOM: NONE; OriginalSymbolOrigin: (-50,25); XY: (7875,8800); VER: 1; ROT: 0; PHYS_PAGE: 161; LOCATION: C16205; DRAWING: @RVP1_ADL_SB_ADP_S_DDR5_SODIMM_2DPC_LIB.H55_DG2_2DPC(SCH_1):PAGE530; CDS_LIB: c_discrete; VARIANT: ?; PCB Footprint: CTK0_SM0603_1850X1050_MA; SEC_TYPE: 0603; CHIPS_PART_NAME: C_CAP; CDS_PART_NAME: C_CAP_0603-602433-105,X5R,22UF,10V,20%,TK0,GENERIC; CDS_LOCATION: C16205
C16206 = C_CAP: CDS_PHYS_PART_NAME: C_CAP_0603-602433-105,X5R,22UF,10V,20%,TK0,GENERIC; CDS_LMAN_SYM_OUTLINE: -50,50,50,-50; FP_TECH: TK0; IP: GENERIC; ROOM: NONE; OriginalSymbolOrigin: (-50,25); XY: (8125,8800); VER: 1; ROT: 0; PHYS_PAGE: 161; LOCATION: C16206; DRAWING: @RVP1_ADL_SB_ADP_S_DDR5_SODIMM_2DPC_LIB.H55_DG2_2DPC(SCH_1):PAGE530; CDS_LIB: c_discrete; VARIANT: ?; PCB Footprint: CTK0_SM0603_1850X1050_MA; SEC_TYPE: 0603; CHIPS_PART_NAME: C_CAP; CDS_PART_NAME: C_CAP_0603-602433-105,X5R,22UF,10V,20%,TK0,GENERIC; CDS_LOCATION: C16206
C16207 = C_CAP#1: PART_NUMBER: A36096-109; CHIPS_PART_NAME: C_CAP; CDS_PHYS_PART_NAME: C_CAP_0402-A36096-109,X5R,2.2UF,10V,20%,TK2,GENERIC; CDS_LMAN_SYM_OUTLINE: -50,50,50,-50; FP_TECH: TK2; IP: GENERIC; ROOM: NONE; OriginalSymbolOrigin: (-25,50); XY: (2175,8150); VER: 2; ROT: 5; PHYS_PAGE: 161; LOCATION: C16207; DRAWING: @RVP1_ADL_SB_ADP_S_DDR5_SODIMM_2DPC_LIB.H55_DG2_2DPC(SCH_1):PAGE530; CDS_LIB: c_discrete; VARIANT: ?; PCB Footprint: CTK2_SM0402_1070X570_MA; CDS_PART_NAME: C_CAP_0402-A36096-109,X5R,2.2UF,10V,20%,TK2,GENERIC; CDS_LOCATION: C16207
C16208 = C_CAP: CDS_PHYS_PART_NAME: C_CAP_0201-D70542-023,C0G,15PF,25V,5%,TK0,GENERIC; CDS_LMAN_SYM_OUTLINE: -50,50,50,-50; FP_TECH: TK0; IP: GENERIC; ROOM: NONE; OriginalSymbolOrigin: (-50,25); XY: (2800,6400); VER: 1; ROT: 0; PHYS_PAGE: 161; LOCATION: C16208; DRAWING: @RVP1_ADL_SB_ADP_S_DDR5_SODIMM_2DPC_LIB.H55_DG2_2DPC(SCH_1):PAGE530; CDS_LIB: c_discrete; VARIANT: ?; PCB Footprint: CTK0_SM0201_630X330_MA; CHIPS_PART_NAME: C_CAP; CDS_PART_NAME: C_CAP_0201-D70542-023,C0G,15PF,25V,5%,TK0,GENERIC; CDS_LOCATION: C16208
C16209 = CAP: CDS_PHYS_PART_NAME: CAP_0201-J54283-001,C0G,3PF,50V,0.1PF,LPDB,GENERIC; OriginalSymbolOrigin: (-50,25); XY: (3225,6375); VER: 1; ROT: 0; PHYS_PAGE: 161; LOCATION: C16209; IP: GENERIC; FP_TECH: LPDB; DRAWING: @RVP1_ADL_SB_ADP_S_DDR5_SODIMM_2DPC_LIB.H55_DG2_2DPC(SCH_1):PAGE530; CDS_LIB: discrete; PCB Footprint: SMC0201MA; CHIPS_PART_NAME: CAP; CDS_PART_NAME: CAP_0201-J54283-001,C0G,3PF,50V,0.1PF,LPDB,GENERIC; CDS_LOCATION: C16209
C16210 = C_CAP: CDS_PHYS_PART_NAME: C_CAP_0201-D70542-023,C0G,15PF,25V,5%,TK0,GENERIC; CDS_LMAN_SYM_OUTLINE: -50,50,50,-50; FP_TECH: TK0; IP: GENERIC; ROOM: NONE; OriginalSymbolOrigin: (-50,25); XY: (3925,6400); VER: 1; ROT: 0; PHYS_PAGE: 161; LOCATION: C16210; DRAWING: @RVP1_ADL_SB_ADP_S_DDR5_SODIMM_2DPC_LIB.H55_DG2_2DPC(SCH_1):PAGE530; CDS_LIB: c_discrete; VARIANT: ?; PCB Footprint: CTK0_SM0201_630X330_MA; CHIPS_PART_NAME: C_CAP; CDS_PART_NAME: C_CAP_0201-D70542-023,C0G,15PF,25V,5%,TK0,GENERIC; CDS_LOCATION: C16210
C16211 = CAP: CDS_PHYS_PART_NAME: CAP_0201-J54283-001,C0G,3PF,50V,0.1PF,LPDB,GENERIC; OriginalSymbolOrigin: (-50,25); XY: (4350,6375); VER: 1; ROT: 0; PHYS_PAGE: 161; LOCATION: C16211; IP: GENERIC; FP_TECH: LPDB; DRAWING: @RVP1_ADL_SB_ADP_S_DDR5_SODIMM_2DPC_LIB.H55_DG2_2DPC(SCH_1):PAGE530; CDS_LIB: discrete; PCB Footprint: SMC0201MA; CHIPS_PART_NAME: CAP; CDS_PART_NAME: CAP_0201-J54283-001,C0G,3PF,50V,0.1PF,LPDB,GENERIC; CDS_LOCATION: C16211
C16212 = C_CAP: CDS_PHYS_PART_NAME: C_CAP_0201-D70542-023,C0G,15PF,25V,5%,TK0,GENERIC; CDS_LMAN_SYM_OUTLINE: -50,50,50,-50; FP_TECH: TK0; IP: GENERIC; ROOM: NONE; OriginalSymbolOrigin: (-50,25); XY: (5075,6350); VER: 1; ROT: 0; PHYS_PAGE: 161; LOCATION: C16212; DRAWING: @RVP1_ADL_SB_ADP_S_DDR5_SODIMM_2DPC_LIB.H55_DG2_2DPC(SCH_1):PAGE530; CDS_LIB: c_discrete; VARIANT: ?; PCB Footprint: CTK0_SM0201_630X330_MA; CHIPS_PART_NAME: C_CAP; CDS_PART_NAME: C_CAP_0201-D70542-023,C0G,15PF,25V,5%,TK0,GENERIC; CDS_LOCATION: C16212
C16213 = CAP: CDS_PHYS_PART_NAME: CAP_0201-J54283-001,C0G,3PF,50V,0.1PF,LPDB,GENERIC; OriginalSymbolOrigin: (-50,25); XY: (5500,6325); VER: 1; ROT: 0; PHYS_PAGE: 161; LOCATION: C16213; IP: GENERIC; FP_TECH: LPDB; DRAWING: @RVP1_ADL_SB_ADP_S_DDR5_SODIMM_2DPC_LIB.H55_DG2_2DPC(SCH_1):PAGE530; CDS_LIB: discrete; PCB Footprint: SMC0201MA; CHIPS_PART_NAME: CAP; CDS_PART_NAME: CAP_0201-J54283-001,C0G,3PF,50V,0.1PF,LPDB,GENERIC; CDS_LOCATION: C16213
CR1E1 = C_DIODE_SCHOTTKY: CDS_PHYS_PART_NAME: C_DIODE_SCHOTTKY_SM-G85592-001,DIO,BAT54XV2T1G,10MA,TK2,GENERIC; CDS_LMAN_SYM_OUTLINE: -50,100,50,-100; FP_TECH: TK2; IP: GENERIC; PACK_TYPE: SM; ROOM: NONE; OriginalSymbolOrigin: (-75,50); XY: (3300,8275); VER: 1; ROT: 0; PHYS_PAGE: 161; LOCATION: CR1E1; DRAWING: @RVP1_ADL_SB_ADP_S_DDR5_SODIMM_2DPC_LIB.H55_DG2_2DPC(SCH_1):PAGE530; CDS_LIB: local; VARIANT: ?; PCB Footprint: CTK2_SCR_1300X900_MA; SEC_TYPE: SM; CHIPS_PART_NAME: C_DIODE_SCHOTTKY; CDS_PART_NAME: C_DIODE_SCHOTTKY_SM-G85592-001,DIO,BAT54XV2T1G,10MA,TK2,GENERIC; CDS_LOCATION: CR1E1
CR1E2 = C_DIODE_SCHOTTKY: CDS_PHYS_PART_NAME: C_DIODE_SCHOTTKY_SM-G85592-001,DIO,BAT54XV2T1G,10MA,TK2,GENERIC; CDS_LMAN_SYM_OUTLINE: -50,100,50,-100; FP_TECH: TK2; IP: GENERIC; PACK_TYPE: SM; ROOM: NONE; OriginalSymbolOrigin: (-75,50); XY: (4350,7525); VER: 1; ROT: 2; PHYS_PAGE: 161; LOCATION: CR1E2; DRAWING: @RVP1_ADL_SB_ADP_S_DDR5_SODIMM_2DPC_LIB.H55_DG2_2DPC(SCH_1):PAGE530; CDS_LIB: local; VARIANT: ?; PCB Footprint: CTK2_SCR_1300X900_MA; SEC_TYPE: SM; CHIPS_PART_NAME: C_DIODE_SCHOTTKY; CDS_PART_NAME: C_DIODE_SCHOTTKY_SM-G85592-001,DIO,BAT54XV2T1G,10MA,TK2,GENERIC; CDS_LOCATION: CR1E2
EU16201 = C_RT6219: CDS_PHYS_PART_NAME: C_RT6219_LCC-J64861-001,IC,RT6219AGQW,TK2,GENERIC; CDS_LMAN_SYM_OUTLINE: -250,350,250,-350; FP_TECH: TK2; IP: GENERIC; PACK_TYPE: LCC; ROOM: NONE; OriginalSymbolOrigin: (-275,350); XY: (4750,8875); VER: 1; ROT: 0; PHYS_PAGE: 161; LOCATION: EU16201; DRAWING: @RVP1_ADL_SB_ADP_S_DDR5_SODIMM_2DPC_LIB.H55_DG2_2DPC(SCH_1):PAGE530; CDS_LIB: local; VARIANT: ?; PCB Footprint: CTK2_LCC10_S3050_DF1625X2475_500_MA; CHIPS_PART_NAME: C_RT6219; CDS_PART_NAME: C_RT6219_LCC-J64861-001,IC,RT6219AGQW,TK2,GENERIC; CDS_LOCATION: EU16201
L1D3 = C_INDUCTOR_POL: CDS_PHYS_PART_NAME: C_INDUCTOR_POL_SM-M20012-001,IND,1UH,20%,7.1A,TK0,GENERIC; CDS_LMAN_SYM_OUTLINE: -100,50,100,-50; FP_TECH: TK0; IP: GENERIC; ROOM: NONE; OriginalSymbolOrigin: (-100,50); XY: (7050,9050); VER: 1; ROT: 0; PHYS_PAGE: 161; LOCATION: L1D3; DRAWING: @RVP1_ADL_SB_ADP_S_DDR5_SODIMM_2DPC_LIB.H55_DG2_2DPC(SCH_1):PAGE530; CDS_LIB: local; VARIANT: ?; PCB Footprint: CTK0_SMI3225M_3350X2650_MA_VR; CHIPS_PART_NAME: C_INDUCTOR_POL; CDS_PART_NAME: C_INDUCTOR_POL_SM-M20012-001,IND,1UH,20%,7.1A,TK0,GENERIC; CDS_LOCATION: L1D3; ASI_MODEL: M20012-001
Q1E1 = C_MOSFET_N#1: CDS_PHYS_PART_NAME: C_MOSFET_N_SOT723-J56149-001,MFET,SSM3K35MFV,TK2,GENERIC; CDS_LMAN_SYM_OUTLINE: -150,150,150,-150; FP_TECH: TK2; IP: GENERIC; PACK_TYPE: SOT723; ROOM: NONE; OriginalSymbolOrigin: (-175,175); XY: (6250,7500); VER: 1; ROT: 0; PHYS_PAGE: 161; LOCATION: Q1E1; DRAWING: @RVP1_ADL_SB_ADP_S_DDR5_SODIMM_2DPC_LIB.H55_DG2_2DPC(SCH_1):PAGE530; CDS_LIB: local; VARIANT: ?; PCB Footprint: CTK2_SOT723_850X1250_400_MA; SEC_TYPE: SOT723; CHIPS_PART_NAME: C_MOSFET_N; CDS_PART_NAME: C_MOSFET_N_SOT723-J56149-001,MFET,SSM3K35MFV,TK2,GENERIC; CDS_LOCATION: Q1E1
Q1E2 = C_MOSFET_N#1: CDS_PHYS_PART_NAME: C_MOSFET_N_SOT23-C81974-001,MFET,BSS138LT3G,TK2,GENERIC; CDS_LMAN_SYM_OUTLINE: -150,150,150,-150; FP_TECH: TK2; IP: GENERIC; PACK_TYPE: SOT23; ROOM: NONE; OriginalSymbolOrigin: (-175,175); XY: (5325,7325); VER: 1; ROT: 0; PHYS_PAGE: 161; LOCATION: Q1E2; DRAWING: @RVP1_ADL_SB_ADP_S_DDR5_SODIMM_2DPC_LIB.H55_DG2_2DPC(SCH_1):PAGE530; CDS_LIB: local; VARIANT: ?; PCB Footprint: CTK2_SOT23_1400X3040_950_MA; SEC_TYPE: SOT23; CHIPS_PART_NAME: C_MOSFET_N; CDS_PART_NAME: C_MOSFET_N_SOT23-C81974-001,MFET,BSS138LT3G,TK2,GENERIC; CDS_LOCATION: Q1E2
R1E10 = C_RES#1: PART_NUMBER: A93549-051; CHIPS_PART_NAME: C_RES; CDS_PHYS_PART_NAME: C_RES_0402-A93549-051,RES,2.2,5%,0.0625W,TK0,GENERIC; CDS_LMAN_SYM_OUTLINE: -50,50,50,-50; FP_TECH: TK0; IP: GENERIC; ROOM: NONE; WATTAGE: 0.0625W; OriginalSymbolOrigin: (-75,25); XY: (5575,9125); VER: 1; ROT: 0; PHYS_PAGE: 161; LOCATION: R1E10; DRAWING: @RVP1_ADL_SB_ADP_S_DDR5_SODIMM_2DPC_LIB.H55_DG2_2DPC(SCH_1):PAGE530; CDS_LIB: c_discrete; VARIANT: ?; PCB Footprint: CTK0_SM0402_1100X550_MA; SEC_TYPE: 0402; CDS_PART_NAME: C_RES_0402-A93549-051,RES,2.2,5%,0.0625W,TK0,GENERIC; CDS_LOCATION: R1E10
R1E11 = C_RES: CDS_PHYS_PART_NAME: C_RES_0402-A93548-034,RES,10K,1%,0.0625W,TK0,GENERIC; CDS_LMAN_SYM_OUTLINE: -50,50,50,-50; FP_TECH: TK0; IP: GENERIC; ROOM: NONE; OriginalSymbolOrigin: (-25,75); XY: (8875,7875); VER: 2; ROT: 0; PHYS_PAGE: 161; LOCATION: R1E11; DRAWING: @RVP1_ADL_SB_ADP_S_DDR5_SODIMM_2DPC_LIB.H55_DG2_2DPC(SCH_1):PAGE530; CDS_LIB: c_discrete; VARIANT: ?; PCB Footprint: CTK0_SM0402_1100X550_MA; SEC_TYPE: 0402; CHIPS_PART_NAME: C_RES; CDS_PART_NAME: C_RES_0402-A93548-034,RES,10K,1%,0.0625W,TK0,GENERIC; CDS_LOCATION: R1E11
R1E14 = C_RES: PART_NUMBER: A93548-031; CDS_PHYS_PART_NAME: C_RES_0402-A93548-031,RES,10,1%,0.0625W,TK0,GENERIC; CDS_LMAN_SYM_OUTLINE: -50,50,50,-50; FP_TECH: TK0; IP: GENERIC; ROOM: NONE; OriginalSymbolOrigin: (-25,75); XY: (8575,8575); VER: 2; ROT: 0; PHYS_PAGE: 161; LOCATION: R1E14; DRAWING: @RVP1_ADL_SB_ADP_S_DDR5_SODIMM_2DPC_LIB.H55_DG2_2DPC(SCH_1):PAGE530; CDS_LIB: c_discrete; VARIANT: ?; PCB Footprint: CTK0_SM0402_1100X550_MA; SEC_TYPE: 0402; CHIPS_PART_NAME: C_RES; CDS_PART_NAME: C_RES_0402-A93548-031,RES,10,1%,0.0625W,TK0,GENERIC; CDS_LOCATION: R1E14
R1E15 = RES_2: PART_NUMBER: A93548-275; CDS_PHYS_PART_NAME: RES_2_0402-A93548-275,RES,8.45K,1%,0.0625W,TK0,GENERIC; CDS_LMAN_SYM_OUTLINE: -50,50,50,-50; FP_TECH: TK0; IP: GENERIC; ROOM: NONE; OriginalSymbolOrigin: (-25,75); XY: (8875,8175); VER: 2; ROT: 0; PHYS_PAGE: 161; LOCATION: R1E15; DRAWING: @RVP1_ADL_SB_ADP_S_DDR5_SODIMM_2DPC_LIB.H55_DG2_2DPC(SCH_1):PAGE530; CDS_LIB: discrete_2; VARIANT: ?; PCB Footprint: TK0_SM0402_1100X550_MD; SEC_TYPE: 0402; CHIPS_PART_NAME: RES_2; CDS_PART_NAME: RES_2_0402-A93548-275,RES,8.45K,1%,0.0625W,TK0,GENERIC; CDS_LOCATION: R1E15
R1E17 = C_RES#1: PART_NUMBER: A36092-043; CHIPS_PART_NAME: C_RES; CDS_PHYS_PART_NAME: C_RES_0402-A36092-043,EMPTY,100,1%,0.0625W,TK0,GENERIC; CDS_LMAN_SYM_OUTLINE: -50,50,50,-50; FP_TECH: TK0; IP: GENERIC; ROOM: NONE; WATTAGE: 0.0625W; OriginalSymbolOrigin: (-75,25); XY: (2825,8275); VER: 1; ROT: 0; PHYS_PAGE: 161; LOCATION: R1E17; DRAWING: @RVP1_ADL_SB_ADP_S_DDR5_SODIMM_2DPC_LIB.H55_DG2_2DPC(SCH_1):PAGE530; CDS_LIB: c_discrete; VARIANT: ?; PCB Footprint: CTK0_SM0402_1050X550_MA; SEC_TYPE: 0402; CDS_PART_NAME: C_RES_0402-A36092-043,EMPTY,100,1%,0.0625W,TK0,GENERIC; CDS_LOCATION: R1E17
R1E21 = C_RES: CDS_PHYS_PART_NAME: C_RES_0402-A93549-001,RES,0,5%,0.0625W,TK0,GENERIC; CDS_LMAN_SYM_OUTLINE: -50,50,50,-50; FP_TECH: TK0; IP: GENERIC; ROOM: NONE; OriginalSymbolOrigin: (-25,75); XY: (9050,8625); VER: 2; PHYS_PAGE: 161; LOCATION: R1E21; DRAWING: @RVP1_ADL_SB_ADP_S_DDR5_SODIMM_2DPC_LIB.H55_DG2_2DPC(SCH_1):PAGE530; CDS_LIB: c_discrete; VARIANT: ?; PCB Footprint: CTK0_SM0402_1100X550_MA; SEC_TYPE: 0402; ROT: 0; CHIPS_PART_NAME: C_RES; CDS_PART_NAME: C_RES_0402-A93549-001,RES,0,5%,0.0625W,TK0,GENERIC; CDS_LOCATION: R1E21
R1E22 = C_RES#1: CHIPS_PART_NAME: C_RES; CDS_PHYS_PART_NAME: C_RES_0402-A93549-001,EMPTY,0,5%,0.0625W,TK0,GENERIC; CDS_LMAN_SYM_OUTLINE: -50,50,50,-50; FP_TECH: TK0; IP: GENERIC; ROOM: NONE; OriginalSymbolOrigin: (-75,25); XY: (2325,6950); VER: 1; PHYS_PAGE: 161; LOCATION: R1E22; DRAWING: @RVP1_ADL_SB_ADP_S_DDR5_SODIMM_2DPC_LIB.H55_DG2_2DPC(SCH_1):PAGE530; CDS_LIB: c_discrete; VARIANT: ?; PCB Footprint: CTK0_SM0402_1100X550_MA; SEC_TYPE: 0402; ROT: 0; CDS_PART_NAME: C_RES_0402-A93549-001,EMPTY,0,5%,0.0625W,TK0,GENERIC; CDS_LOCATION: R1E22
R1E27 = C_RES: CDS_PHYS_PART_NAME: C_RES_0402-A93548-128,EMPTY,100K,1%,0.0625W,TK0,GENERIC; CDS_LMAN_SYM_OUTLINE: -50,50,50,-50; FP_TECH: TK0; IP: GENERIC; ROOM: NONE; OriginalSymbolOrigin: (-25,75); XY: (6775,7975); VER: 2; ROT: 0; PHYS_PAGE: 161; LOCATION: R1E27; DRAWING: @RVP1_ADL_SB_ADP_S_DDR5_SODIMM_2DPC_LIB.H55_DG2_2DPC(SCH_1):PAGE530; CDS_LIB: c_discrete; VARIANT: ?; PCB Footprint: CTK0_SM0402_1100X550_MA; SEC_TYPE: 0402; CHIPS_PART_NAME: C_RES; CDS_PART_NAME: C_RES_0402-A93548-128,EMPTY,100K,1%,0.0625W,TK0,GENERIC; CDS_LOCATION: R1E27
R1E28 = C_RES#1: CHIPS_PART_NAME: C_RES; CDS_PHYS_PART_NAME: C_RES_0402-A93549-001,RES,0,5%,0.0625W,TK0,GENERIC; CDS_LMAN_SYM_OUTLINE: -50,50,50,-50; FP_TECH: TK0; IP: GENERIC; ROOM: NONE; OriginalSymbolOrigin: (-75,25); XY: (3675,8825); VER: 1; PHYS_PAGE: 161; LOCATION: R1E28; DRAWING: @RVP1_ADL_SB_ADP_S_DDR5_SODIMM_2DPC_LIB.H55_DG2_2DPC(SCH_1):PAGE530; CDS_LIB: c_discrete; VARIANT: ?; PCB Footprint: CTK0_SM0402_1100X550_MA; SEC_TYPE: 0402; ROT: 0; CDS_PART_NAME: C_RES_0402-A93549-001,RES,0,5%,0.0625W,TK0,GENERIC; CDS_LOCATION: R1E28
R1E29 = C_RES#1: CHIPS_PART_NAME: C_RES; CDS_PHYS_PART_NAME: C_RES_0402-A93549-001,RES,0,5%,0.0625W,TK0,GENERIC; CDS_LMAN_SYM_OUTLINE: -50,50,50,-50; FP_TECH: TK0; IP: GENERIC; ROOM: NONE; OriginalSymbolOrigin: (-75,25); XY: (3000,7850); VER: 1; PHYS_PAGE: 161; LOCATION: R1E29; DRAWING: @RVP1_ADL_SB_ADP_S_DDR5_SODIMM_2DPC_LIB.H55_DG2_2DPC(SCH_1):PAGE530; CDS_LIB: c_discrete; VARIANT: ?; PCB Footprint: CTK0_SM0402_1100X550_MA; SEC_TYPE: 0402; ROT: 0; CDS_PART_NAME: C_RES_0402-A93549-001,RES,0,5%,0.0625W,TK0,GENERIC; CDS_LOCATION: R1E29
R1E30 = C_RES#1: CHIPS_PART_NAME: C_RES; CDS_PHYS_PART_NAME: C_RES_0402-A93549-001,RES,0,5%,0.0625W,TK0,GENERIC; CDS_LMAN_SYM_OUTLINE: -50,50,50,-50; FP_TECH: TK0; IP: GENERIC; ROOM: NONE; OriginalSymbolOrigin: (-75,25); XY: (2325,7450); VER: 1; PHYS_PAGE: 161; LOCATION: R1E30; DRAWING: @RVP1_ADL_SB_ADP_S_DDR5_SODIMM_2DPC_LIB.H55_DG2_2DPC(SCH_1):PAGE530; CDS_LIB: c_discrete; VARIANT: ?; PCB Footprint: CTK0_SM0402_1100X550_MA; SEC_TYPE: 0402; ROT: 0; CDS_PART_NAME: C_RES_0402-A93549-001,RES,0,5%,0.0625W,TK0,GENERIC; CDS_LOCATION: R1E30
R1E32 = C_RES#1: CHIPS_PART_NAME: C_RES; CDS_PHYS_PART_NAME: C_RES_0402-A93549-001,RES,0,5%,0.0625W,TK0,GENERIC; CDS_LMAN_SYM_OUTLINE: -50,50,50,-50; FP_TECH: TK0; IP: GENERIC; ROOM: NONE; OriginalSymbolOrigin: (-75,25); XY: (3900,8275); VER: 1; PHYS_PAGE: 161; LOCATION: R1E32; DRAWING: @RVP1_ADL_SB_ADP_S_DDR5_SODIMM_2DPC_LIB.H55_DG2_2DPC(SCH_1):PAGE530; CDS_LIB: c_discrete; VARIANT: ?; PCB Footprint: CTK0_SM0402_1100X550_MA; SEC_TYPE: 0402; ROT: 0; CDS_PART_NAME: C_RES_0402-A93549-001,RES,0,5%,0.0625W,TK0,GENERIC; CDS_LOCATION: R1E32
R1E36 = C_RES: CDS_PHYS_PART_NAME: C_RES_0402-A93548-128,RES,100K,1%,0.0625W,TK2,GENERIC; CDS_LMAN_SYM_OUTLINE: -50,50,50,-50; FP_TECH: TK2; IP: GENERIC; ROOM: NONE; OriginalSymbolOrigin: (-25,75); XY: (5325,7700); VER: 2; ROT: 0; PHYS_PAGE: 161; LOCATION: R1E36; DRAWING: @RVP1_ADL_SB_ADP_S_DDR5_SODIMM_2DPC_LIB.H55_DG2_2DPC(SCH_1):PAGE530; CDS_LIB: c_discrete; VARIANT: ?; PCB Footprint: CTK2_SM0402_1100X550_MA; SEC_TYPE: 0402; CHIPS_PART_NAME: C_RES; CDS_PART_NAME: C_RES_0402-A93548-128,RES,100K,1%,0.0625W,TK2,GENERIC; CDS_LOCATION: R1E36
R1E37 = C_RES#1: CHIPS_PART_NAME: C_RES; CDS_PHYS_PART_NAME: C_RES_0402-A93549-023,RES,10K,5%,0.0625W,TK0,GENERIC; CDS_LMAN_SYM_OUTLINE: -50,50,50,-50; FP_TECH: TK0; IP: GENERIC; ROOM: NONE; OriginalSymbolOrigin: (-75,25); XY: (4275,7200); VER: 1; ROT: 0; PHYS_PAGE: 161; LOCATION: R1E37; DRAWING: @RVP1_ADL_SB_ADP_S_DDR5_SODIMM_2DPC_LIB.H55_DG2_2DPC(SCH_1):PAGE530; CDS_LIB: c_discrete; VARIANT: ?; PCB Footprint: CTK0_SM0402_1100X550_MA; SEC_TYPE: 0402; CDS_PART_NAME: C_RES_0402-A93549-023,RES,10K,5%,0.0625W,TK0,GENERIC; CDS_LOCATION: R1E37
R2G9 = C_RES#1: CHIPS_PART_NAME: C_RES; CDS_PHYS_PART_NAME: C_RES_0402-A93549-001,RES,0,5%,0.0625W,TK0,GENERIC; CDS_LMAN_SYM_OUTLINE: -50,50,50,-50; FP_TECH: TK0; IP: GENERIC; ROOM: NONE; OriginalSymbolOrigin: (-75,25); XY: (8375,6675); VER: 1; PHYS_PAGE: 161; LOCATION: R2G9; DRAWING: @RVP1_ADL_SB_ADP_S_DDR5_SODIMM_2DPC_LIB.H55_DG2_2DPC(SCH_1):PAGE530; CDS_LIB: c_discrete; VARIANT: ?; PCB Footprint: CTK0_SM0402_1100X550_MA; SEC_TYPE: 0402; ROT: 0; CDS_PART_NAME: C_RES_0402-A93549-001,RES,0,5%,0.0625W,TK0,GENERIC; CDS_LOCATION: R2G9
R2G10 = C_RES: CDS_PHYS_PART_NAME: C_RES_0402-A93549-001,RES,0,5%,0.0625W,TK0,GENERIC; CDS_LMAN_SYM_OUTLINE: -50,50,50,-50; FP_TECH: TK0; IP: GENERIC; ROOM: NONE; OriginalSymbolOrigin: (-25,75); XY: (7675,6450); VER: 2; PHYS_PAGE: 161; LOCATION: R2G10; DRAWING: @RVP1_ADL_SB_ADP_S_DDR5_SODIMM_2DPC_LIB.H55_DG2_2DPC(SCH_1):PAGE530; CDS_LIB: c_discrete; VARIANT: ?; PCB Footprint: CTK0_SM0402_1100X550_MA; SEC_TYPE: 0402; ROT: 0; CHIPS_PART_NAME: C_RES; CDS_PART_NAME: C_RES_0402-A93549-001,RES,0,5%,0.0625W,TK0,GENERIC; CDS_LOCATION: R2G10
R2G12 = C_RES#1: CHIPS_PART_NAME: C_RES; CDS_PHYS_PART_NAME: C_RES_0402-A93549-001,RES,0,5%,0.0625W,TK0,GENERIC; CDS_LMAN_SYM_OUTLINE: -50,50,50,-50; FP_TECH: TK0; IP: GENERIC; ROOM: NONE; OriginalSymbolOrigin: (-75,25); XY: (8375,7050); VER: 1; PHYS_PAGE: 161; LOCATION: R2G12; DRAWING: @RVP1_ADL_SB_ADP_S_DDR5_SODIMM_2DPC_LIB.H55_DG2_2DPC(SCH_1):PAGE530; CDS_LIB: c_discrete; VARIANT: ?; PCB Footprint: CTK0_SM0402_1100X550_MA; SEC_TYPE: 0402; ROT: 0; CDS_PART_NAME: C_RES_0402-A93549-001,RES,0,5%,0.0625W,TK0,GENERIC; CDS_LOCATION: R2G12
R16201 = C_RES_4TERM: CDS_PHYS_PART_NAME: C_RES_4TERM_1206_SM-G52199-004,RES,0.002,1%,1W,TK2,GENERIC; CDS_LMAN_SYM_OUTLINE: -50,50,50,-50; FP_TECH: TK2; IP: GENERIC; ROOM: NONE; OriginalSymbolOrigin: (-75,25); XY: (2550,10325); VER: 1; ROT: 0; PHYS_PAGE: 161; LOCATION: R16201; DRAWING: @RVP1_ADL_SB_ADP_S_DDR5_SODIMM_2DPC_LIB.H55_DG2_2DPC(SCH_1):PAGE530; CDS_LIB: c_discrete; VARIANT: ?; PCB Footprint: CTK2_SMR4_1206_3454X1854_ME; CHIPS_PART_NAME: C_RES_4TERM; CDS_PART_NAME: C_RES_4TERM_1206_SM-G52199-004,RES,0.002,1%,1W,TK2,GENERIC; CDS_LOCATION: R16201
R16202 = C_RES: CDS_PHYS_PART_NAME: C_RES_0402-A93549-001,EMPTY,0,5%,0.0625W,TK2,GENERIC; CDS_LMAN_SYM_OUTLINE: -50,50,50,-50; FP_TECH: TK2; IP: GENERIC; ROOM: NONE; OriginalSymbolOrigin: (-25,75); XY: (4375,8025); VER: 2; PHYS_PAGE: 161; LOCATION: R16202; DRAWING: @RVP1_ADL_SB_ADP_S_DDR5_SODIMM_2DPC_LIB.H55_DG2_2DPC(SCH_1):PAGE530; CDS_LIB: c_discrete; VARIANT: ?; PCB Footprint: CTK2_SM0402_1100X550_MA; ROT: 0; CHIPS_PART_NAME: C_RES; CDS_PART_NAME: C_RES_0402-A93549-001,EMPTY,0,5%,0.0625W,TK2,GENERIC; CDS_LOCATION: R16202
R16203 = C_RES: CDS_PHYS_PART_NAME: C_RES_0603-A93550-549,RES,5.1,1%,0.1W,TK2,GENERIC; CDS_LMAN_SYM_OUTLINE: -50,50,50,-50; FP_TECH: TK2; IP: GENERIC; ROOM: NONE; OriginalSymbolOrigin: (-25,75); XY: (1900,8450); VER: 2; ROT: 5; PHYS_PAGE: 161; LOCATION: R16203; DRAWING: @RVP1_ADL_SB_ADP_S_DDR5_SODIMM_2DPC_LIB.H55_DG2_2DPC(SCH_1):PAGE530; CDS_LIB: c_discrete; VARIANT: ?; PCB Footprint: CTK2_SM0603_1800X900_MA; CHIPS_PART_NAME: C_RES; CDS_PART_NAME: C_RES_0603-A93550-549,RES,5.1,1%,0.1W,TK2,GENERIC; CDS_LOCATION: R16203